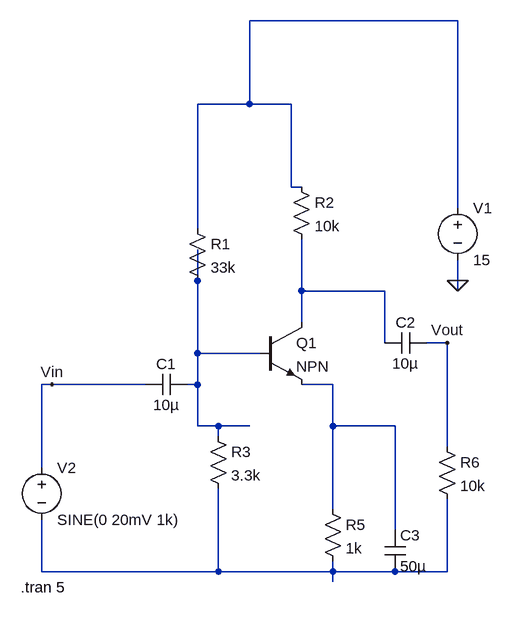
[diagram p0: schematic Draft8.asc]
Draft8.asc, the LTspice schematic file:
Version 4
SHEET 1 880 680
WIRE 336 -272 16 -272
WIRE 16 -144 16 -272
WIRE 16 -144 -64 -144
WIRE 80 -144 16 -144
WIRE 80 -16 80 -144
WIRE 96 -16 80 -16
WIRE 336 16 336 -272
WIRE -64 48 -64 -144
WIRE -64 128 -64 80
WIRE 336 128 336 96
WIRE 96 144 96 64
WIRE 224 144 96 144
WIRE 336 144 336 128
WIRE 96 192 96 144
WIRE 224 224 224 144
WIRE 320 224 288 224
WIRE -64 240 -64 128
WIRE 32 240 -64 240
WIRE -288 288 -304 288
WIRE -144 288 -288 288
WIRE -64 288 -64 240
WIRE -64 288 -80 288
WIRE 144 288 96 288
WIRE -64 352 -64 288
WIRE -32 352 -64 352
WIRE 16 352 -32 352
WIRE 144 352 144 288
WIRE 240 352 144 352
WIRE -32 368 -32 352
WIRE 320 384 320 224
WIRE -304 416 -304 288
WIRE 144 480 144 352
WIRE 240 512 240 352
WIRE -304 576 -304 496
WIRE -32 576 -32 448
WIRE -32 576 -304 576
WIRE 144 576 144 560
WIRE 144 576 -32 576
WIRE 240 576 144 576
WIRE 320 576 320 464
WIRE 320 576 240 576
WIRE 144 592 144 576
FLAG 336 128 0
FLAG -288 288 Vin
FLAG 320 224 Vout
SYMBOL voltage 336 0 R0
WINDOW 123 0 0 Left 0
WINDOW 39 0 0 Left 0
SYMATTR InstName V1
SYMATTR Value 15
SYMBOL voltage -304 400 R0
WINDOW 123 0 0 Left 0
WINDOW 39 0 0 Left 0
SYMATTR InstName V2
SYMATTR Value SINE(0 20mV 1k)
SYMBOL cap -80 272 R90
WINDOW 0 0 32 VBottom 2
WINDOW 3 32 32 VTop 2
SYMATTR InstName C1
SYMATTR Value 10µ
SYMBOL cap 288 208 R90
WINDOW 0 0 32 VBottom 2
WINDOW 3 32 32 VTop 2
SYMATTR InstName C2
SYMATTR Value 10µ
SYMBOL res -80 32 R0
SYMATTR InstName R1
SYMATTR Value 33k
SYMBOL res 80 -32 R0
SYMATTR InstName R2
SYMATTR Value 10k
SYMBOL res -48 352 R0
SYMATTR InstName R3
SYMATTR Value 3.3k
SYMBOL res 128 464 R0
SYMATTR InstName R5
SYMATTR Value 1k
SYMBOL res 304 368 R0
SYMATTR InstName R6
SYMATTR Value 10k
SYMBOL npn 32 192 R0
SYMATTR InstName Q1
SYMBOL cap 224 512 R0
SYMATTR InstName C3
SYMATTR Value 50µ
TEXT -336 600 Left 2 !.tran 5

The netlist it stands for:
* Draft8.asc
V1 N001 0 15
V2 Vin N005 SINE(0 20mV 1k)
C1 N002 Vin 10µ
C2 Vout N003 10µ
R1 N001 N002 33k
R2 N001 N003 10k
R3 N002 N005 3.3k
R5 N004 N005 1k
R6 Vout N005 10k
Q1 N003 N002 N004 0 NPN
C3 N004 N005 50µ
.model NPN NPN
.model PNP PNP
.lib standard.bjt
.tran 5
.backanno
.end